# Altium project Iot_Flatform.PrjPcb
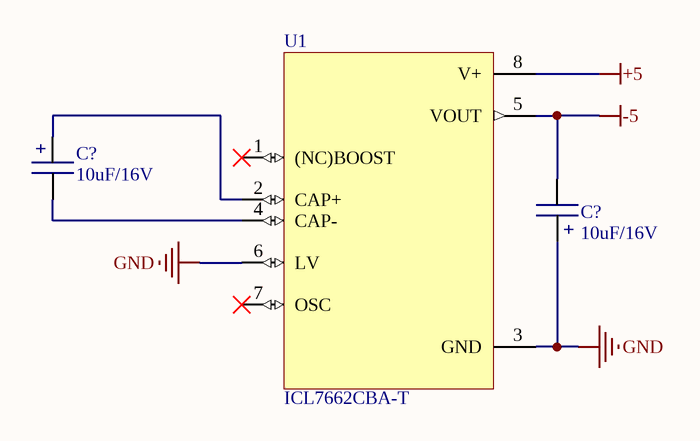
[diagram p0: Power_Supply.SchDoc]
11 sheets, 75 parts. Net scope: flat (ports and power ports of the same name join across sheets).
Sheets:
  Power_Supply.SchDoc
  MCU_STM32.SchDoc
  MCU_ESP32.SchDoc
  MCU_SIM.SchDoc
  Modbus_RTU.SchDoc
  Analog_input.SchDoc
  Analog_output.SchDoc
  Ethernet.SchDoc
  Digital_IN_OUT.SchDoc
  LCD.SchDoc
  Encoder_Key.SchDoc

## Sheet Power_Supply.SchDoc
size A; SheetNumber: 1; SheetTotal: 10

### Parts
(Parts that share a designator on the sheet are numbered #1, #2 ... from top to bottom, then left to right.)
C?#1  10uF/16V  [TANTALUM SMD C]
C?#2  10uF/16V  [TANTALUM SMD C]
U1  ICL7662CBA-T  [SOIC127P600X175-8N]

### Nets
+5: U1.8(V+)
-5: C?#2.1 U1.5(VOUT)
GND: C?#2.2 U1.3(GND) U1.6(LV)
NetC?#1_1: C?#1.1 U1.4(CAP-)
NetC?#1_2: C?#1.2 U1.2(CAP+)

Not connected (* = marked no-connect by the designer): U1 1((NC)BOOST)* 7(OSC)*

### Notes on the sheet
- (in symbol Capacitor_Polarized_TA) +

### Library data of the parts
C?#1 C?#2 = Capacitor_Polarized_TA: Size: 2312; URL: https://www.thegioiic.com/tu-tantalum-10uf-16v-2312-tajc106k016rnj; Value: 10uF/16V
U1 = ICL7662CBA-T: Size: 8-SOIC; Value: ICL7662CBA; URL: https://www.thegioiic.com/icl7662cba

## Sheet MCU_STM32.SchDoc
size A; SheetNumber: 2; SheetTotal: 11
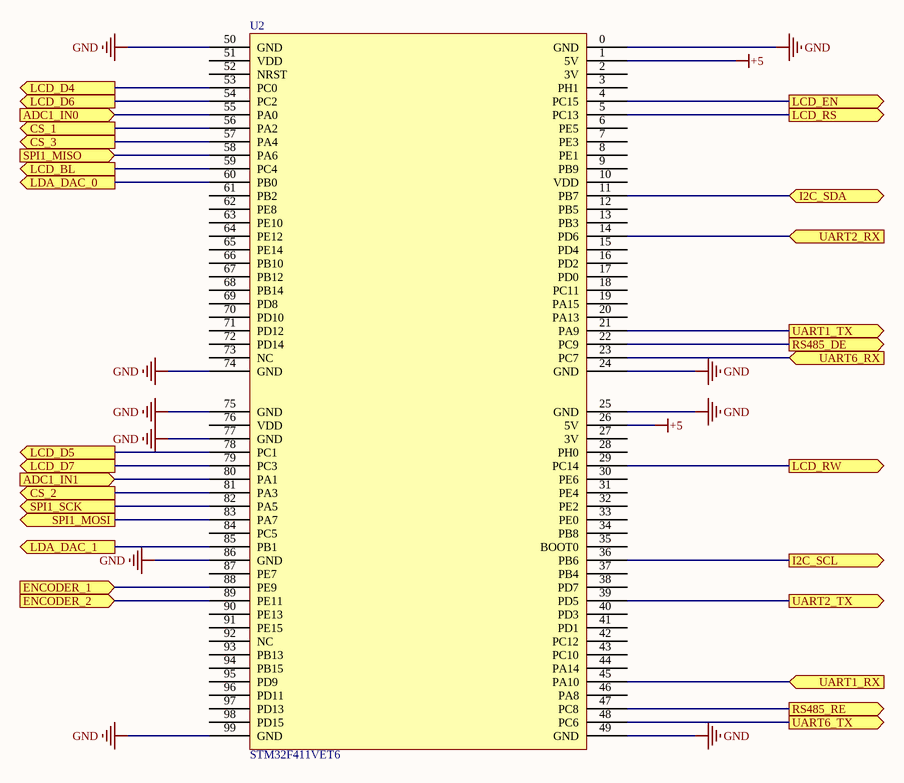
[diagram p1: MCU_STM32.SchDoc]

### Parts
U2  STM32F411VET6  [STM32F4]

### Ports
ADC1_IN0 (in), ADC1_IN1 (in), CS_1 (out), CS_2 (out), CS_3 (out), ENCODER_1 (in), ENCODER_2 (in), I2C_SCL (out), I2C_SDA (bidir), LCD_BL (out), LCD_D4 (out), LCD_D5 (out), LCD_D6 (out), LCD_D7 (out), LCD_EN (out), LCD_RS (out), LCD_RW (out), LDA_DAC_0 (out), LDA_DAC_1 (out), RS485_DE (out), RS485_RE (out), SPI1_MISO (in), SPI1_MOSI (out), SPI1_SCK (out), UART1_RX (in), UART1_TX (out), UART2_RX (in), UART2_TX (out), UART6_RX (in), UART6_TX (out)

### Nets
+5: U2.1(5V) U2.26(5V)
GND: U2.0(GND) U2.24(GND) U2.25(GND) U2.49(GND) U2.50(GND) U2.74(GND) U2.75(GND) U2.77(GND) U2.86(GND) U2.99(GND)
NetR?#17_2: U2.80(PA1) ; port ADC1_IN1
NetU2_4: U2.4(PC15) ; port LCD_EN
NetU2_5: U2.5(PC13) ; port LCD_RS
NetU2_11: U2.11(PB7) ; port I2C_SDA
NetU2_14: U2.14(PD6) ; port UART2_RX
NetU2_21: U2.21(PA9) ; port UART1_TX
NetU2_22: U2.22(PC9) ; port RS485_DE
NetU2_23: U2.23(PC7) ; port UART6_RX
NetU2_29: U2.29(PC14) ; port LCD_RW
NetU2_36: U2.36(PB6) ; port I2C_SCL
NetU2_39: U2.39(PD5) ; port UART2_TX
NetU2_45: U2.45(PA10) ; port UART1_RX
NetU2_47: U2.47(PC8) ; port RS485_RE
NetU2_48: U2.48(PC6) ; port UART6_TX
NetU2_53: U2.53(PC0) ; port LCD_D4
NetU2_54: U2.54(PC2) ; port LCD_D6
NetU2_55: U2.55(PA0) ; port ADC1_IN0
NetU2_56: U2.56(PA2) ; port CS_1
NetU2_57: U2.57(PA4) ; port CS_3
NetU2_58: U2.58(PA6) ; port SPI1_MISO
NetU2_59: U2.59(PC4) ; port LCD_BL
NetU2_60: U2.60(PB0) ; port LDA_DAC_0
NetU2_78: U2.78(PC1) ; port LCD_D5
NetU2_79: U2.79(PC3) ; port LCD_D7
NetU2_81: U2.81(PA3) ; port CS_2
NetU2_82: U2.82(PA5) ; port SPI1_SCK
NetU2_83: U2.83(PA7) ; port SPI1_MOSI
NetU2_85: U2.85(PB1) ; port LDA_DAC_1
NetU2_88: U2.88(PE9) ; port ENCODER_1
NetU2_89: U2.89(PE11) ; port ENCODER_2

Not connected (* = marked no-connect by the designer): U2 2(3V) 3(PH1) 6(PE5) 7(PE3) 8(PE1) 9(PB9) 10(VDD) 12(PB5) 13(PB3) 15(PD4) 16(PD2) 17(PD0) 18(PC11) 19(PA15) 20(PA13) 27(3V) 28(PH0) 30(PE6) 31(PE4) 32(PE2) 33(PE0) 34(PB8) 35(BOOT0) 37(PB4) 38(PD7) 40(PD3) 41(PD1) 42(PC12) 43(PC10) 44(PA14) 46(PA8) 51(VDD) 52(NRST) 61(PB2) 62(PE8) 63(PE10) 64(PE12) 65(PE14) 66(PB10) 67(PB12) 68(PB14) 69(PD8) 70(PD10) 71(PD12) 72(PD14) 73(NC) 76(VDD) 84(PC5) 87(PE7) 90(PE13) 91(PE15) 92(NC) 93(PB13) 94(PB15) 95(PD9) 96(PD11) 97(PD13) 98(PD15)

## Sheet MCU_ESP32.SchDoc
size A; SheetNumber: 3; SheetTotal: 10
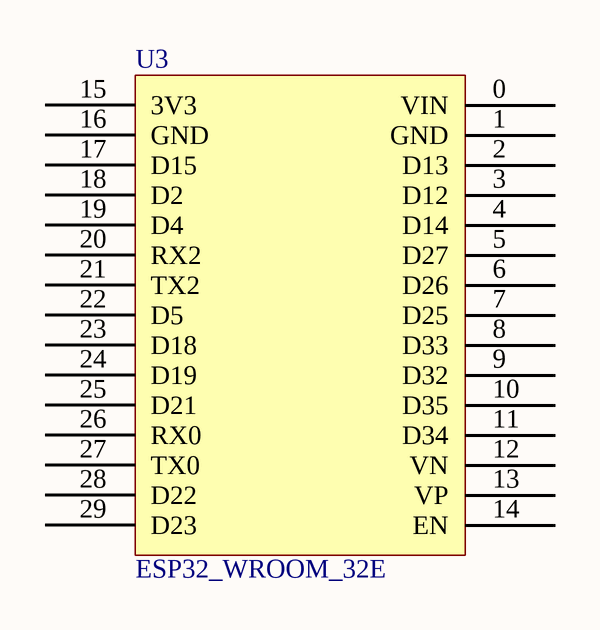
[diagram p2: MCU_ESP32.SchDoc]

### Parts
U3  ESP32_WROOM_32E  [ESP32_WROOM_32E]

### Nets

Not connected (* = marked no-connect by the designer): U3 0(VIN) 1(GND) 2(D13) 3(D12) 4(D14) 5(D27) 6(D26) 7(D25) 8(D33) 9(D32) 10(D35) 11(D34) 12(VN) 13(VP) 14(EN) 15(3V3) 16(GND) 17(D15) 18(D2) 19(D4) 20(RX2) 21(TX2) 22(D5) 23(D18) 24(D19) 25(D21) 26(RX0) 27(TX0) 28(D22) 29(D23)

## Sheet MCU_SIM.SchDoc
size A; SheetNumber: 4; SheetTotal: 10
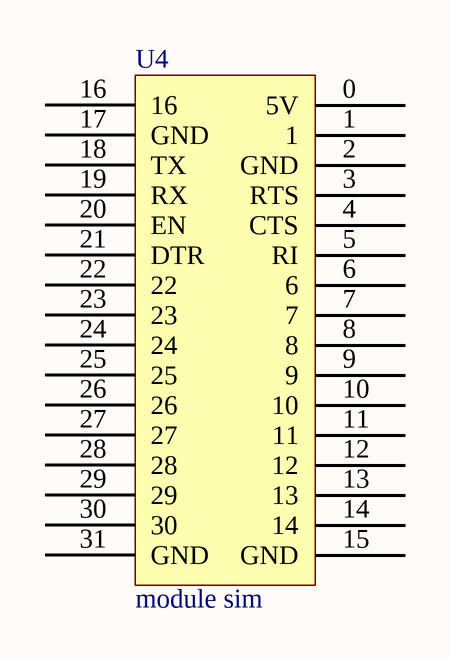
[diagram p3: MCU_SIM.SchDoc]

### Parts
U4  module sim  [SIM7600CE]

### Nets

Not connected (* = marked no-connect by the designer): U4 0(5V) 1 2(GND) 3(RTS) 4(CTS) 5(RI) 6 7 8 9 10 11 12 13 14 15(GND) 16 17(GND) 18(TX) 19(RX) 20(EN) 21(DTR) 22 23 24 25 26 27 28 29 30 31(GND)

### Library data of the parts
U4 = Module SIM7600CE

## Sheet Modbus_RTU.SchDoc
size A; SheetNumber: 5; SheetTotal: 10
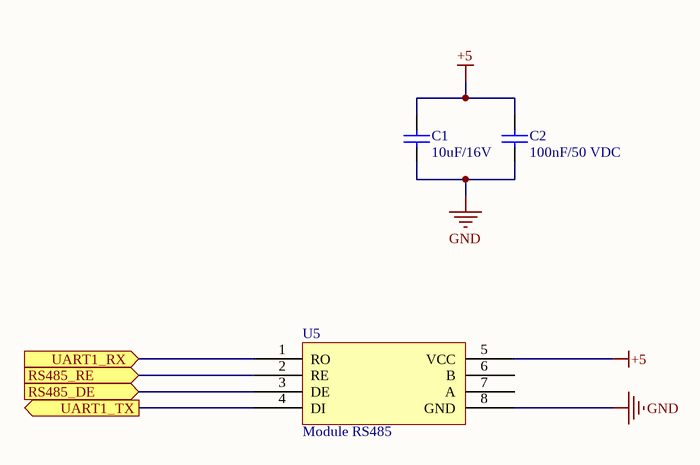
[diagram p4: Modbus_RTU.SchDoc]

### Parts
C1  10uF/16V  [CAP_0805]
C2  100nF/50 VDC  [CAP_0805]
U5  Module RS485  [MODULE_RS485]

### Ports
RS485_DE (in), RS485_RE (in), UART1_RX (in), UART1_TX (out)

### Nets
+5: C1.2 C2.2 U5.5(VCC)
GND: C1.1 C2.1 U5.8(GND)
NetU2_21: U5.4(DI) ; port UART1_TX
NetU2_22: U5.3(DE) ; port RS485_DE
NetU2_45: U5.1(RO) ; port UART1_RX
NetU2_47: U5.2(RE) ; port RS485_RE

Not connected (* = marked no-connect by the designer): U5 6(B) 7(A)

### Library data of the parts
C1 = 0108058281050: CAP, size 0805, 10uF, 16V; Tolerance: +/-5%; Voltage Rating DC: 16 VDC; ComponentLink2Description: Datasheet; Size: 0805; URL: https://www.thegioiic.com/tu-gom-0805-10uf-16v; Value: 10uF/16V
C2 = 0108058281050: CAP, size 0805, 100nF, 50 VDC; Tolerance: +/-5%; ComponentLink2Description: Datasheet; Size: 0805; URL: https://www.thegioiic.com/tu-gom-0805-100nf-0-1uf-50v; Value: 100nF/50 VDC
U5 = Module RS485: Using module through UART

## Sheet Analog_input.SchDoc
size A; SheetNumber: 6; SheetTotal: 10
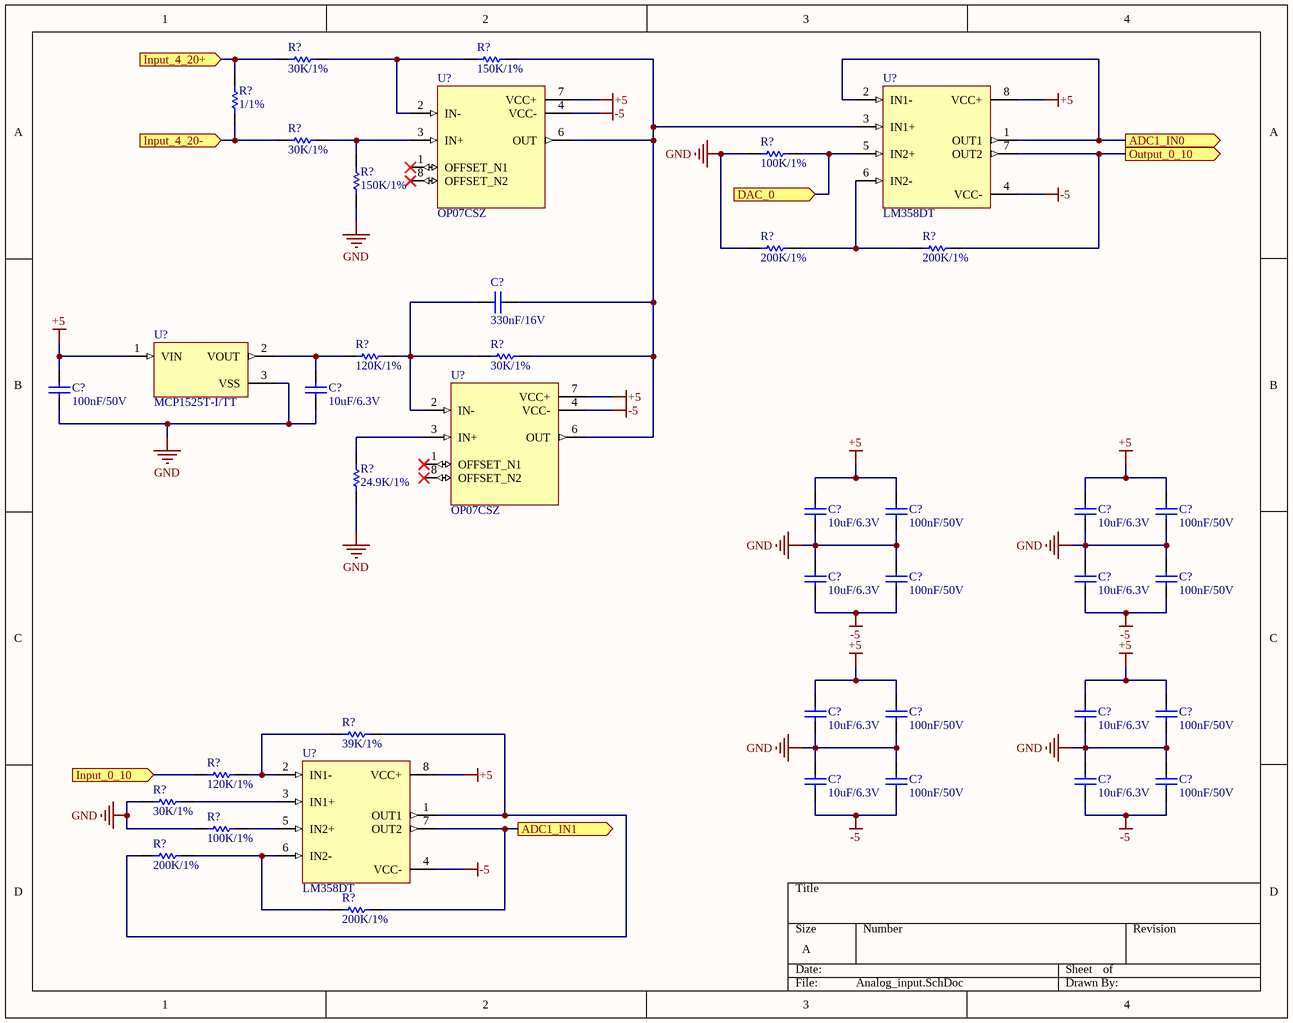
[diagram p5: Analog_input.SchDoc]

### Parts
(Parts that share a designator on the sheet are numbered #1, #2 ... from top to bottom, then left to right.)
C?#3  330nF/16V  [CAP_0805]
C?#4  100nF/50V  [CAP_0805]
C?#5  10uF/6.3V  [CAP_0805]
C?#6  10uF/6.3V  [CAP_0805]
C?#7  100nF/50V  [CAP_0805]
C?#8  10uF/6.3V  [CAP_0805]
C?#9  100nF/50V  [CAP_0805]
C?#10  10uF/6.3V  [CAP_0805]
C?#11  100nF/50V  [CAP_0805]
C?#12  10uF/6.3V  [CAP_0805]
C?#13  100nF/50V  [CAP_0805]
C?#14  10uF/6.3V  [CAP_0805]
C?#15  100nF/50V  [CAP_0805]
C?#16  10uF/6.3V  [CAP_0805]
C?#17  100nF/50V  [CAP_0805]
C?#18  10uF/6.3V  [CAP_0805]
C?#19  100nF/50V  [CAP_0805]
C?#20  10uF/6.3V  [CAP_0805]
C?#21  100nF/50V  [CAP_0805]
R?#1  30K/1%  [RES_0805]
R?#2  150K/1%  [RES_0805]
R?#3  1/1%  [RES_0805]
R?#4  30K/1%  [RES_0805]
R?#5  100K/1%  [RES_0805]
R?#6  150K/1%  [RES_0805]
R?#7  200K/1%  [RES_0805]
R?#8  200K/1%  [RES_0805]
R?#9  120K/1%  [RES_0805]
R?#10  30K/1%  [RES_0805]
R?#11  24.9K/1%  [RES_0805]
R?#12  39K/1%  [RES_0805]
R?#13  120K/1%  [RES_0805]
R?#14  30K/1%  [RES_0805]
R?#15  100K/1%  [RES_0805]
R?#16  200K/1%  [RES_0805]
R?#17  200K/1%  [RES_0805]
U?#1  OP07CSZ  [SOIC127P600X175-8N]
U?#2  LM358DT  [SOIC127P600X175-8N]
U?#3  MCP1525T-I/TT  [SOT95P237X112-3N]
U?#4  OP07CSZ  [SOIC127P600X175-8N]
U?#5  LM358DT  [SOIC127P600X175-8N]

### Ports
ADC1_IN0 (out), ADC1_IN1 (out), DAC_0 (in), Input_0_10 (in), Input_4_20+ (in), Input_4_20- (in), Output_0_10 (out)

### Nets
+5: C?#4.2 C?#6.2 C?#7.2 C?#8.2 C?#9.2 C?#14.2 C?#15.2 C?#16.2 C?#17.2 U?#1.7(VCC+) U?#2.8(VCC+) U?#3.1(VIN) U?#4.7(VCC+) U?#5.8(VCC+)
-5: C?#10.1 C?#11.1 C?#12.1 C?#13.1 C?#18.1 C?#19.1 C?#20.1 C?#21.1 U?#1.4(VCC-) U?#2.4(VCC-) U?#4.4(VCC-) U?#5.4(VCC-)
GND: C?#4.1 C?#5.1 C?#6.1 C?#7.1 C?#8.1 C?#9.1 C?#10.2 C?#11.2 C?#12.2 C?#13.2 C?#14.1 C?#15.1 C?#16.1 C?#17.1 C?#18.2 C?#19.2 C?#20.2 C?#21.2 R?#5.1 R?#6.1 R?#7.1 R?#11.1 R?#14.1 R?#15.1 U?#3.3(VSS)
NetC?#3_1: C?#3.1 R?#2.2 R?#10.2 U?#1.6(OUT) U?#2.3(IN1+) U?#4.6(OUT)
NetC?#3_2: C?#3.2 R?#9.2 R?#10.1 U?#4.2(IN-)
NetC?#5_2: C?#5.2 R?#9.1 U?#3.2(VOUT)
NetR?#1_1: R?#1.1 R?#3.2 ; port Input_4_20+
NetR?#1_2: R?#1.2 R?#2.1 U?#1.2(IN-)
NetR?#3_1: R?#3.1 R?#4.1 ; port Input_4_20-
NetR?#4_2: R?#4.2 R?#6.2 U?#1.3(IN+)
NetR?#5_2: R?#5.2 U?#2.5(IN2+) ; port DAC_0
NetR?#7_2: R?#7.2 R?#8.1 U?#2.6(IN2-)
NetR?#8_2: R?#8.2 U?#2.7(OUT2) ; port Output_0_10
NetR?#11_2: R?#11.2 U?#4.3(IN+)
NetR?#12_1: R?#12.1 R?#13.2 U?#5.2(IN1-)
NetR?#12_2: R?#12.2 R?#16.1 U?#5.1(OUT1)
NetR?#13_1: R?#13.1 ; port Input_0_10
NetR?#14_2: R?#14.2 U?#5.3(IN1+)
NetR?#15_2: R?#15.2 U?#5.5(IN2+)
NetR?#16_2: R?#16.2 R?#17.1 U?#5.6(IN2-)
NetR?#17_2: R?#17.2 U?#5.7(OUT2) ; port ADC1_IN1
NetU2_55: U?#2.1(OUT1) U?#2.2(IN1-) ; port ADC1_IN0

Not connected (* = marked no-connect by the designer): U?#1 1(OFFSET_N1)* 8(OFFSET_N2)*; U?#4 1(OFFSET_N1)* 8(OFFSET_N2)*

### Library data of the parts
C?#3-C?#21 = Capacitor: Size: 0805
  C?#3: URL: https://www.thegioiic.com/tu-gom-0805-330nf-16v; Value: 330nF/16V
  C?#4 C?#7 C?#9 C?#11 C?#13 C?#15 C?#17 C?#19 C?#21: URL: https://www.thegioiic.com/tu-gom-0805-100nf-0-1uf-50v; Value: 100nF/50V
  C?#5 C?#6 C?#8 C?#10 C?#12 C?#14 C?#16 C?#18 C?#20: URL: https://www.thegioiic.com/tu-gom-0805-10uf-6-3v; Value: 10uF/6.3V
R?#1-R?#17 = Resistor: Size: 0805
  R?#1 R?#4 R?#10 R?#14: URL: https://www.thegioiic.com/dien-tro-30-kohm-0805-1-; Value: 30K/1%
  R?#2 R?#6: URL: https://www.thegioiic.com/dien-tro-150-kohm-0805-1-; Value: 150K/1%
  R?#3: URL: https://www.thegioiic.com/dien-tro-1-ohm-0805-1-https://www.thegioiic.com/dien-tro-1-ohm-0805-1-; Value: 1/1%
  R?#5 R?#15: URL: https://www.thegioiic.com/dien-tro-100-kohm-0805-1-; Value: 100K/1%
  R?#7 R?#8 R?#16 R?#17: URL: https://www.thegioiic.com/dien-tro-200-kohm-0805-1-; Value: 200K/1%
  R?#9 R?#13: URL: https://www.thegioiic.com/dien-tro-120-kohm-0805-1-; Value: 120K/1%
  R?#11: URL: https://www.thegioiic.com/dien-tro-24-9-kohm-0805-1-; Value: 24.9K/1%
  R?#12: URL: https://www.thegioiic.com/dien-tro-39-kohm-0805-1-; Value: 39K/1%
U?#1 U?#4 = OP07CSZ: Low-Offset Voltage Operational Amplifier; Size: 8-SOIC; URL: https://www.thegioiic.com/op07csz-ic-opamp-general-purpose-amplifier-1-circuit-600khz-8-soic; Value: OP07CSZ
U?#2 U?#5 = LM358DT: General Purpose Amplifier 2 Circuit 8-SO; Size: 8-SOIC; URL: https://www.thegioiic.com/lm358dt-ic-opamp-general-purpose-amplifier-2-circuit-1-1mhz-8-soic; Value: LM358DT
U?#3 = MCP1525T-I/TT: Series Voltage Reference IC Â±1% SOT-23-3; Value: 2.5VDC; Size: SOT-23; URL: https://www.thegioiic.com/mcp1525t-i-tt-ic-tham-chieu-dien-ap-2-5v-sot-23

## Sheet Analog_output.SchDoc
size A; SheetNumber: 7; SheetTotal: 11
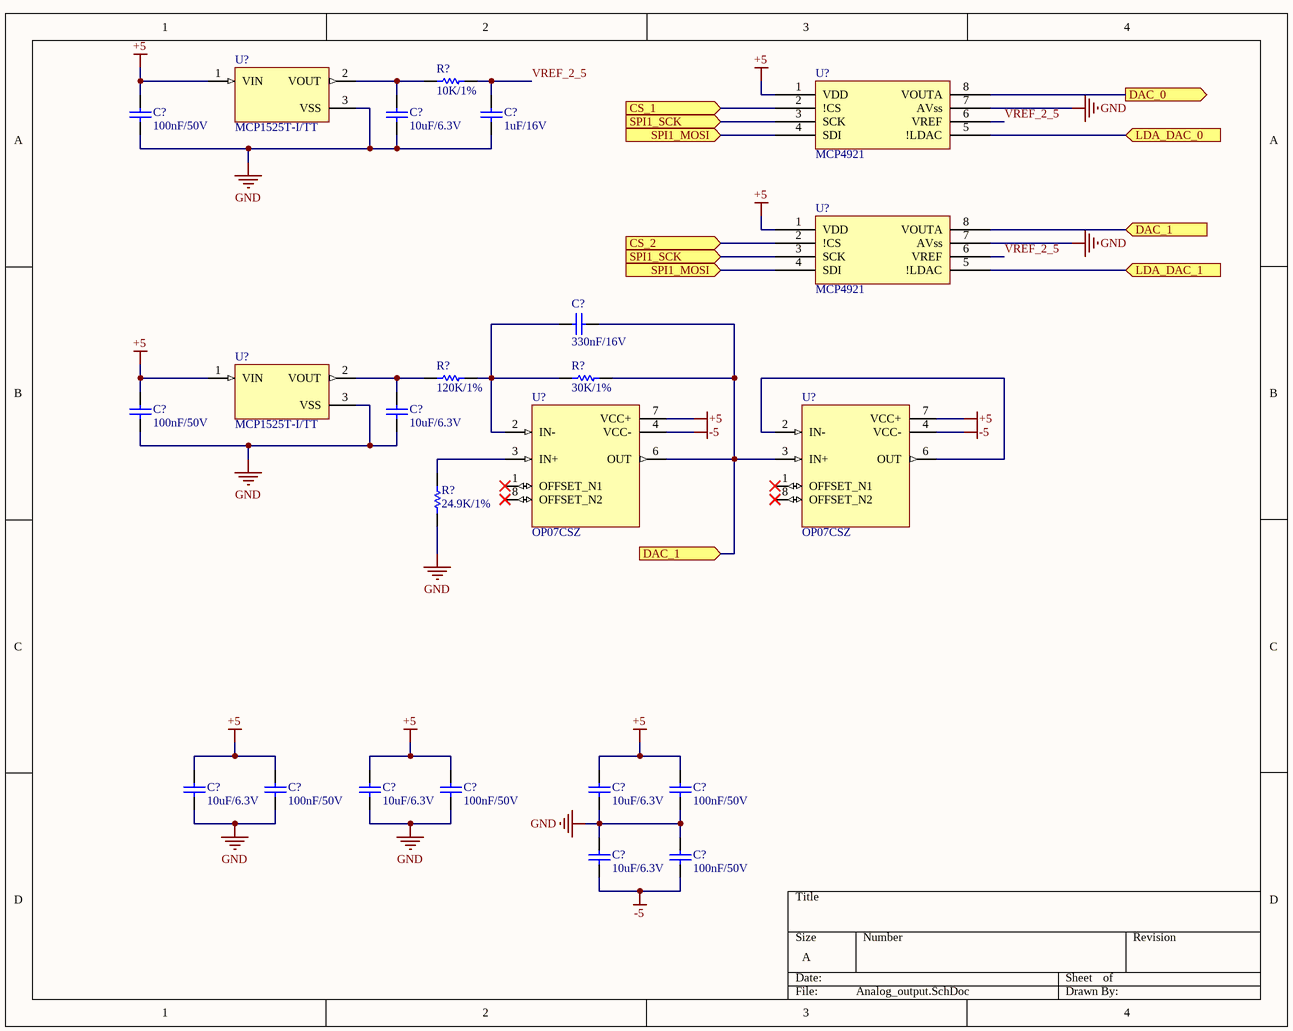
[diagram p6: Analog_output.SchDoc]

### Parts
(Parts that share a designator on the sheet are numbered #1, #2 ... from top to bottom, then left to right.)
C?#22  100nF/50V  [CAP_0805]
C?#23  10uF/6.3V  [CAP_0805]
C?#24  1uF/16V  [CAP_0805]
C?#25  330nF/16V  [CAP_0805]
C?#26  100nF/50V  [CAP_0805]
C?#27  10uF/6.3V  [CAP_0805]
C?#28  10uF/6.3V  [CAP_0805]
C?#29  100nF/50V  [CAP_0805]
C?#30  10uF/6.3V  [CAP_0805]
C?#31  100nF/50V  [CAP_0805]
C?#32  10uF/6.3V  [CAP_0805]
C?#33  100nF/50V  [CAP_0805]
C?#34  10uF/6.3V  [CAP_0805]
C?#35  100nF/50V  [CAP_0805]
R?#18  10K/1%  [RES_0805]
R?#19  120K/1%  [RES_0805]
R?#20  30K/1%  [RES_0805]
R?#21  24.9K/1%  [RES_0805]
U?#6  MCP1525T-I/TT  [SOT95P237X112-3N]
U?#7  MCP4921  [SOIC127P600X175-8N]
U?#8  MCP4921  [SOIC127P600X175-8N]
U?#9  MCP1525T-I/TT  [SOT95P237X112-3N]
U?#10  OP07CSZ  [SOIC127P600X175-8N]
U?#11  OP07CSZ  [SOIC127P600X175-8N]

### Ports
CS_1 (in), CS_2 (in), DAC_0 (out), DAC_1 (in), LDA_DAC_0 (in), LDA_DAC_1 (in), SPI1_MOSI (in), SPI1_SCK (in)

### Nets
+5: C?#22.2 C?#26.2 C?#28.2 C?#29.2 C?#30.2 C?#31.2 C?#32.2 C?#33.2 U?#6.1(VIN) U?#7.1(VDD) U?#8.1(VDD) U?#9.1(VIN) U?#10.7(VCC+) U?#11.7(VCC+)
-5: C?#34.1 C?#35.1 U?#10.4(VCC-) U?#11.4(VCC-)
GND: C?#22.1 C?#23.1 C?#24.1 C?#26.1 C?#27.1 C?#28.1 C?#29.1 C?#30.1 C?#31.1 C?#32.1 C?#33.1 C?#34.2 C?#35.2 R?#21.1 U?#6.3(VSS) U?#7.7(AVss) U?#8.7(AVss) U?#9.3(VSS)
VREF_2_5: C?#24.2 R?#18.1 U?#7.6(VREF) U?#8.6(VREF)
NetC?#23_2: C?#23.2 R?#18.2 U?#6.2(VOUT)
NetC?#25_1: C?#25.1 R?#20.2 U?#8.8(VOUTA) U?#10.6(OUT) U?#11.3(IN+) ; port DAC_1
NetC?#25_2: C?#25.2 R?#19.2 R?#20.1 U?#10.2(IN-)
NetC?#27_2: C?#27.2 R?#19.1 U?#9.2(VOUT)
NetR?#5_2: U?#7.8(VOUTA) ; port DAC_0
NetR?#21_2: R?#21.2 U?#10.3(IN+)
NetU2_56: U?#7.2(!CS) ; port CS_1
NetU2_60: U?#7.5(!LDAC) ; port LDA_DAC_0
NetU2_81: U?#8.2(!CS) ; port CS_2
NetU2_82: U?#7.3(SCK) U?#8.3(SCK) ; port SPI1_SCK
NetU2_83: U?#7.4(SDI) U?#8.4(SDI) ; port SPI1_MOSI
NetU2_85: U?#8.5(!LDAC) ; port LDA_DAC_1
NetU?#11_2: U?#11.2(IN-) U?#11.6(OUT)

Not connected (* = marked no-connect by the designer): U?#10 1(OFFSET_N1)* 8(OFFSET_N2)*; U?#11 1(OFFSET_N1)* 8(OFFSET_N2)*

### Library data of the parts
C?#22-C?#35 = Capacitor: Size: 0805
  C?#22 C?#26 C?#29 C?#31 C?#33 C?#35: URL: https://www.thegioiic.com/tu-gom-0805-100nf-0-1uf-50v; Value: 100nF/50V
  C?#23 C?#27 C?#28 C?#30 C?#32 C?#34: URL: https://www.thegioiic.com/tu-gom-0805-10uf-6-3v; Value: 10uF/6.3V
  C?#24: URL: https://www.thegioiic.com/tu-gom-0805-1uf-16v; Value: 1uF/16V
  C?#25: URL: https://www.thegioiic.com/tu-gom-0805-330nf-16v; Value: 330nF/16V
R?#18-R?#21 = Resistor: Size: 0805
  R?#18: URL: https://www.thegioiic.com/dien-tro-10-kohm-0805-1-; Value: 10K/1%
  R?#19: URL: https://www.thegioiic.com/dien-tro-120-kohm-0805-1-; Value: 120K/1%
  R?#20: URL: https://www.thegioiic.com/dien-tro-30-kohm-0805-1-; Value: 30K/1%
  R?#21: URL: https://www.thegioiic.com/dien-tro-24-9-kohm-0805-1-; Value: 24.9K/1%
U?#6 U?#9 = MCP1525T-I/TT: as U?#3 on sheet Analog_input; Size: SOT-23; URL: https://www.thegioiic.com/mcp1525t-i-tt-ic-tham-chieu-dien-ap-2-5v-sot-23
U?#7 U?#8 = MCP4921: Interface SPI; Value: MCP4921-E/SN; Size: 8-SOIC; URL: https://www.thegioiic.com/mcp4921-e-sn-ic-dac-12-bit-1-channel-8-soic
U?#10 U?#11 = OP07CSZ: Low-Offset Voltage Operational Amplifier; Size: 8-SOIC; URL: https://www.thegioiic.com/op07csz-ic-opamp-general-purpose-amplifier-1-circuit-600khz-8-soic; Value: OP07CSZ

## Sheet Ethernet.SchDoc
size A; SheetNumber: 8; SheetTotal: 11

## Sheet Digital_IN_OUT.SchDoc
size A; SheetNumber: 9; SheetTotal: 9

## Sheet LCD.SchDoc
size A; SheetNumber: 9; SheetTotal: 10
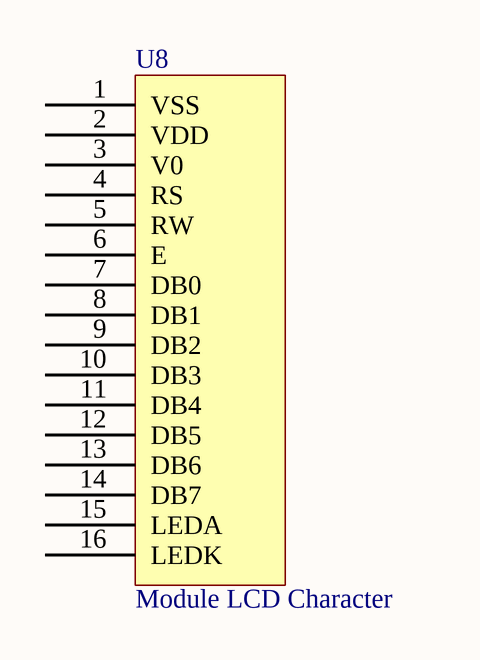
[diagram p7: LCD.SchDoc]

### Parts
U8  Module LCD Character  [LCD_1604]

### Nets

Not connected (* = marked no-connect by the designer): U8 1(VSS) 2(VDD) 3(V0) 4(RS) 5(RW) 6(E) 7(DB0) 8(DB1) 9(DB2) 10(DB3) 11(DB4) 12(DB5) 13(DB6) 14(DB7) 15(LEDA) 16(LEDK)

### Library data of the parts
U8 = Module LCD Character: Interface GPIO

## Sheet Encoder_Key.SchDoc
size A; SheetNumber: 11; SheetTotal: 11

## Nets that join several sheets
+5: Power_Supply (U1.8), MCU_STM32 (U2.1 U2.26), Modbus_RTU (C1.2 C2.2 U5.5), Analog_input (14 pins), Analog_output (14 pins)
-5: Power_Supply (C?#2.1 U1.5), Analog_input (12 pins), Analog_output (C?#34.1 C?#35.1 U?#10.4 U?#11.4)
GND: Power_Supply (C?#2.2 U1.3 U1.6), MCU_STM32 (10 pins), Modbus_RTU (C1.1 C2.1 U5.8), Analog_input (25 pins), Analog_output (18 pins)
NetR?#5_2: Analog_input (R?#5.2 U?#2.5), Analog_output (U?#7.8)
NetR?#17_2: MCU_STM32 (U2.80), Analog_input (R?#17.2 U?#5.7)
NetU2_21: MCU_STM32 (U2.21), Modbus_RTU (U5.4)
NetU2_22: MCU_STM32 (U2.22), Modbus_RTU (U5.3)
NetU2_45: MCU_STM32 (U2.45), Modbus_RTU (U5.1)
NetU2_47: MCU_STM32 (U2.47), Modbus_RTU (U5.2)
NetU2_55: MCU_STM32 (U2.55), Analog_input (U?#2.1 U?#2.2)
NetU2_56: MCU_STM32 (U2.56), Analog_output (U?#7.2)
NetU2_60: MCU_STM32 (U2.60), Analog_output (U?#7.5)
NetU2_81: MCU_STM32 (U2.81), Analog_output (U?#8.2)
NetU2_82: MCU_STM32 (U2.82), Analog_output (U?#7.3 U?#8.3)
NetU2_83: MCU_STM32 (U2.83), Analog_output (U?#7.4 U?#8.4)
NetU2_85: MCU_STM32 (U2.85), Analog_output (U?#8.5)